# EAGLE design sed1200emu (EAGLE 6.2)
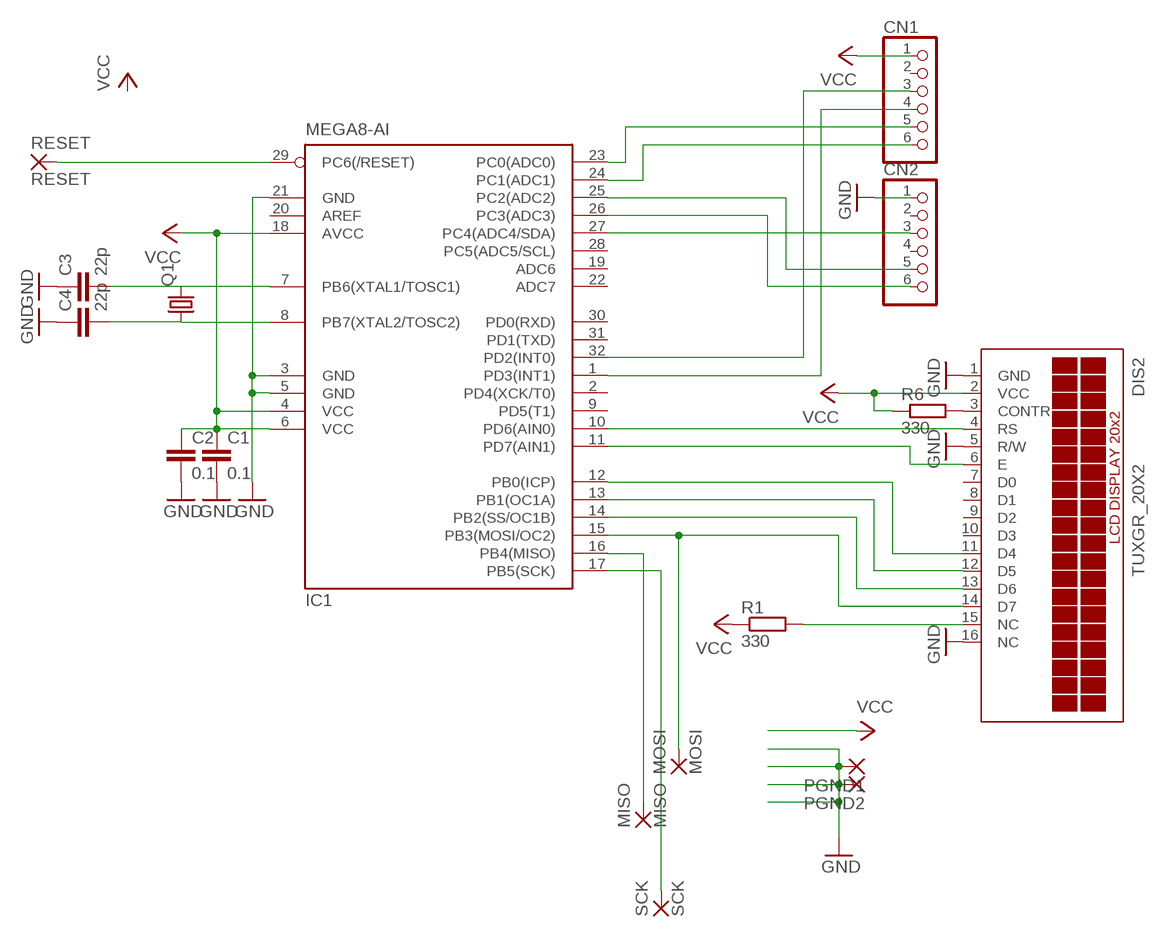
[diagram p0: schematic, sheet 1]

## Parts
C1  0.1  C-EUC0805  [C0805]
C2  0.1  C-EUC0805  [C0805]
C3  22p  C-EUC0805  [C0805]
C4  22p  C-EUC0805  [C0805]
CN1  PINHD-1X6  [1X06]
CN2  PINHD-1X6  [1X06]
DIS2  TUXGR_20X2  [TUXGR_20X2]
IC1  MEGA8-AI  [TQFP32-08]
MISO  MISO  2,15/1,0  [2,15/1,0]
MOSI  MOSI  2,15/1,0  [2,15/1,0]
PGND1  2,15/1,0  [2,15/1,0]
PGND2  2,15/1,0  [2,15/1,0]
Q1  CRYSTALHC49S  [HC49/S]
R1  330  R-EU_M0805  [M0805]
R6  330  R-EU_M0805  [M0805]
RESET  RESET  2,15/1,0  [2,15/1,0]
SCK  SCK  2,15/1,0  [2,15/1,0]

## Nets
GND: C1.2 C2.2 C3.1 C4.1 CN2.1 DIS2.1(GND) DIS2.5(R/W) DIS2.16(NC) IC1.3(GND) IC1.5(GND) IC1.21(GND) PGND1.1(P) PGND2.1(P)
N$1: CN2.3 IC1.27(PC4(ADC4/SDA))
N$2: CN1.5 IC1.23(PC0(ADC0))
N$3: CN1.6 IC1.24(PC1(ADC1))
N$4: CN2.5 IC1.25(PC2(ADC2))
N$5: IC1.29(PC6(/RESET)) RESET.1(P)
N$6: CN2.6 IC1.26(PC3(ADC3))
N$7: DIS2.15(NC) R1.2
N$10: DIS2.6(E) IC1.11(PD7(AIN1))
N$11: C3.2 IC1.7(PB6(XTAL1/TOSC1)) Q1.2
N$12: DIS2.4(RS) IC1.10(PD6(AIN0))
N$13: C4.2 IC1.8(PB7(XTAL2/TOSC2)) Q1.1
N$14: DIS2.3(CONTR) R6.2
N$17: DIS2.11(D4) IC1.12(PB0(ICP))
N$18: DIS2.12(D5) IC1.13(PB1(OC1A))
N$19: DIS2.13(D6) IC1.14(PB2(SS/OC1B))
N$20: DIS2.14(D7) IC1.15(PB3(MOSI/OC2)) MOSI.1(P)
N$21: IC1.16(PB4(MISO)) MISO.1(P)
N$22: IC1.17(PB5(SCK)) SCK.1(P)
PS2CLK: CN1.3 IC1.32(PD2(INT0))
PS2DATA: CN1.4 IC1.1(PD3(INT1))
VCC: C1.1 C2.1 CN1.1 DIS2.2(VCC) IC1.4(VCC) IC1.6(VCC) IC1.18(AVCC) R1.1 R6.1
Unconnected: CN1.2 CN2.2 CN2.4 DIS2.7(D0) DIS2.8(D1) DIS2.9(D2) DIS2.10(D3) IC1.2(PD4(XCK/T0)) IC1.9(PD5(T1)) IC1.19(ADC6) IC1.20(AREF) IC1.22(ADC7) IC1.28(PC5(ADC5/SCL)) IC1.30(PD0(RXD)) IC1.31(PD1(TXD))

## Library data of the parts
C1-C4 = rcl:C-EU: CAPACITOR, European symbol
CN1 CN2 = pinhead:PINHD-1X6: PIN HEADER
DIS2 = display-lcd:TUXGR_20X2: Tuxgraphics LCD display 20x2 characters reflective, without background light Source: tuxgr_20x2.pdf; OC_FARNELL: unknown; OC_NEWARK: unknown
IC1 = atmel:MEGA8: MICROCONTROLLER 8 Kbytes FLASH, 1 kbytes SRAM, 512 bytes EEPROM, USART, 6-channel 10 bit ADC, 2-channel 8 bit ADC Pin compatible with Atmega48, ATMega88, ATMega168 Source: avr.lbr; MPN: ATMEGA8-16AU; OC_FARNELL: 9171371; OC_NEWARK: 73M8863
MISO MOSI PGND1 PGND2 RESET SCK = wirepad:2,15/1,0: THROUGH-HOLE PAD
Q1 = crystal:CRYSTAL: CRYSTAL; OC_FARNELL: 1667008; OC_NEWARK: unknown
R1 R6 = resistor:R-EU_: RESISTOR, European symbol

## Board
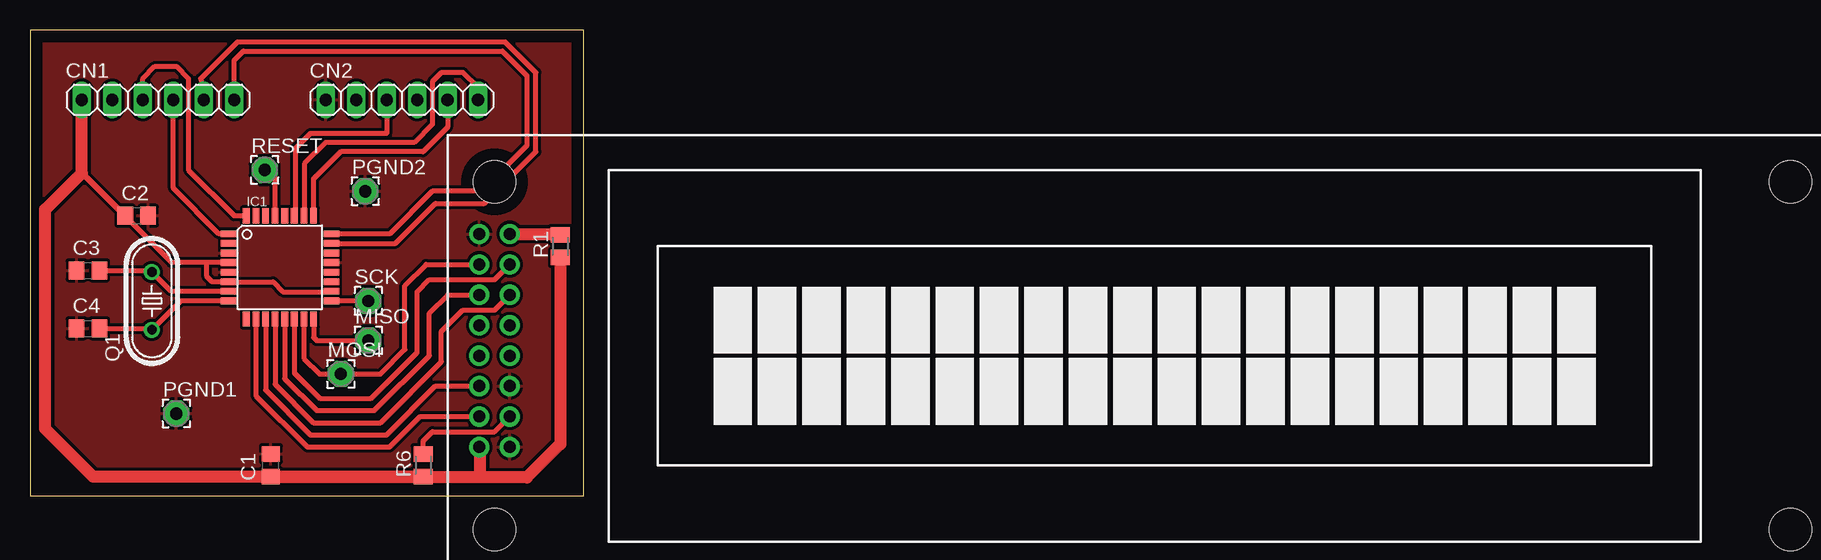
[diagram p1: board, top side]

Size 46.15 x 38.85 mm. Coordinates in mm from the lower left corner, seen from the top.
Outline: 0,0 46.15,0 46.15,38.85 0,38.85 0,0
Copper layers (1*16): Top 0.035mm / dielectric 1.5mm / Bottom 0.035mm
Design rules: minimum track width 10mil, minimum drill 24mil, track to track 10mil, track to pad 10mil, pad to pad 10mil, via to via 10mil, smd to smd 10mil, copper to edge 40mil, drill to drill 8mil, minimum pad ring 10mil, minimum via ring 8mil, stop-mask expansion 4mil, vias tented up to drill 0mil, thermal gap 10mil

### Footprints (pad centres in the part's own frame; a part is rotated, then mirrored left to right if it is on the bottom)
C0805 = smd 1.3 x 1.5: 1 -0.95,0; 2 0.95,0
1X06 = drill 1.016 long: 1 -6.35,0; 2 -3.81,0; 3 -1.27,0; 4 1.27,0; 5 3.81,0; 6 6.35,0
TUXGR_20X2 = drill 1 pad 1.676: 1 -52.73,-7.62; 2 -55.27,-7.62; 3 -52.73,-5.08; 4 -55.27,-5.08; 5 -52.73,-2.54; 6 -55.27,-2.54; 7 -52.73,0; 8 -55.27,0; 9 -52.73,2.54; 10 -55.27,2.54; 11 -52.73,5.08; 12 -55.27,5.08; 13 -52.73,7.62; 14 -55.27,7.62; 15 -52.73,10.16; 16 -55.27,10.16 | hole 3.5: -54,-14.5; 54,-14.5; -54,14.5; 54,14.5
TQFP32-08 = smd 1.27 x 0.559: 1 -4.293,2.8; 2 -4.293,2; 3 -4.293,1.2; 4 -4.293,0.4; 5 -4.293,-0.4; 6 -4.293,-1.2; 7 -4.293,-2; 8 -4.293,-2.8; 17 4.293,-2.8; 18 4.293,-2; 19 4.293,-1.2; 20 4.293,-0.4; 21 4.293,0.4; 22 4.293,1.2; 23 4.293,2; 24 4.293,2.8 | smd 0.559 x 1.27: 9 -2.8,-4.293; 10 -2,-4.293; 11 -1.2,-4.293; 12 -0.4,-4.293; 13 0.4,-4.293; 14 1.2,-4.293; 15 2,-4.293; 16 2.8,-4.293; 25 2.8,4.293; 26 2,4.293; 27 1.2,4.293; 28 0.4,4.293; 29 -0.4,4.293; 30 -1.2,4.293; 31 -2,4.293; 32 -2.8,4.293
2,15/1,0 = drill 1.016 pad 2.159 octagon: 1 0,0
HC49/S = drill 0.813: 1 -2.413,0; 2 2.413,0
M0805 = smd 1.3 x 1.6: 1 -0.95,0; 2 0.95,0

### Placement (x,y rotation side)
C1  20.07,2.54 90 top
C2  8.89,23.37 0 top
C3  4.83,18.8 0 top
C4  4.83,13.97 0 top
CN1  10.67,33.02 0 top
CN2  30.99,33.02 0 top
DIS2  92.71,11.68 0 top
IC1  20.83,19.05 0 top
MISO  28.19,12.95 0 top
MOSI  25.91,10.16 0 top
PGND1  12.19,6.86 0 top
PGND2  27.94,25.4 0 top
Q1  10.16,16.26 90 top
R1  44.2,20.83 90 top
R6  32.77,2.54 90 top
RESET  19.56,27.18 0 top
SCK  28.19,16.26 0 top

### Tracks (layer width: path | path; a pad name or v marks a point on that pad's centre or on a via)
GND
  pour Top: 0.25,38.61 45.97,38.61 45.97,0.25 0.25,0.25
N$1
  Top 0.406: CN2.3 29.72,30.23 23.37,30.23 22.1,28.96 22.1,23.41 IC1.27
N$2
  Top 0.406: IC1.23 30.45,21.05 33.78,24.38 37.85,24.38 42.16,28.7 42.16,35.31 39.62,37.85 17.27,37.85 14.22,34.8 CN1.5
N$3
  Top 0.406: CN1.6 17.02,36.32 17.78,37.08 39.37,37.08 41.4,35.05 41.4,29.21 37.59,25.4 33.53,25.4 29.97,21.84 IC1.24
N$4
  Top 0.406: CN2.5 34.8,30.73 32.77,28.7 25.91,28.7 23.62,26.42 IC1.25
N$5
  Top 0.254: RESET.1 20.07,27.18 20.43,26.82
  Top 0.406: IC1.29 20.43,26.82
N$6
  Top 0.406: CN2.6 37.34,34.04 36.07,35.31 34.29,35.31 33.53,34.54 33.53,30.99 32,29.46 24.64,29.46 22.86,27.69 22.86,23.37 IC1.26
N$7
  Top 1.016: DIS2.15 44.13,21.84 R1.2
N$10
  Top 0.406: IC1.11 19.63,8.82 23.37,5.08 29.72,5.08 33.78,9.14 DIS2.6
N$11
  Top 0.406: IC1.7 11.78,17.05 Q1.2 10.03,18.8 C3.2
N$12
  Top 0.406: IC1.10 18.83,8.35 23.11,4.06 29.97,4.06 32.51,6.6 DIS2.4
N$13
  Top 0.406: IC1.8 12.57,16.25 Q1.1 10.03,13.97 C4.2
N$14
  Top 0.406: R6.2 32.77,4.57 33.53,5.33 38.71,5.33 DIS2.3
N$17
  Top 0.406: IC1.12 20.43,9.29 23.62,6.1 29.21,6.1 34.29,11.18 34.29,13.72 36.07,15.49 38.71,15.49 DIS2.11
N$18
  Top 0.406: IC1.13 21.23,9.76 23.88,7.11 28.7,7.11 33.27,11.68 33.27,15.24 34.8,16.76 DIS2.12
N$19
  Top 0.406: IC1.14 22.03,10.23 24.13,8.13 28.45,8.13 32.26,11.94 32.26,17.02 33.27,18.03 38.71,18.03 DIS2.13
N$20
  Top 0.406: IC1.15 22.83,11.46 24.13,10.16 MOSI.1 29.21,10.16 31.24,12.19 31.24,17.53 33.02,19.3 DIS2.14
N$21
  Top 0.406: IC1.16 23.63,13.2 23.88,12.95 MISO.1
N$22
  Top 0.406: SCK.1 IC1.17
PS2CLK
  Top 0.406: CN1.3 9.4,34.8 10.41,35.81 12.19,35.81 13.21,34.8 13.21,27.18 17.02,23.37 18,23.37 IC1.32
PS2DATA
  Top 0.406: IC1.1 15.74,21.85 11.94,25.65 CN1.4
VCC
  Top 0.406: IC1.4 14.73,19.45 | 14.73,19.45 11.79,19.45 4.32,26.92 4.38,26.92 C2.1 | 14.73,19.45 14.73,18.29 15.17,17.85 IC1.6 20.25,17.85 21.08,17.02 25.09,17.02 IC1.18
  Top 1.016: CN1.1 4.32,26.92 1.27,23.88 1.27,5.59 5.27,1.59 R6.1 | C1.1 R6.1 | R6.1 37.51,1.59 37.51,4 DIS2.2 | R6.1 32.83,1.52 41.4,1.52 44.2,4.32 R1.1